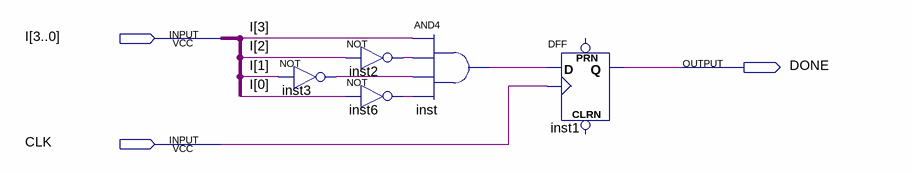
[diagram p0: schematic sheet]
// Quartus schematic DC.bdf as structural Verilog: 5 symbols, 3 pins
module DC (
  input  [3:0] I,
  input  CLK,
  output DONE
);

  wire inst2_out, inst3_out, inst6_out, inst_out;

  not inst3 (inst3_out, I[1]);
  not inst2 (inst2_out, I[2]);
  not inst6 (inst6_out, I[0]);
  and inst (inst_out, I[3], inst2_out, inst3_out, inst6_out);
  DFF inst1 (.CLK(CLK), .D(inst_out), .Q(DONE));  // open: CLRN, PRN
endmodule
